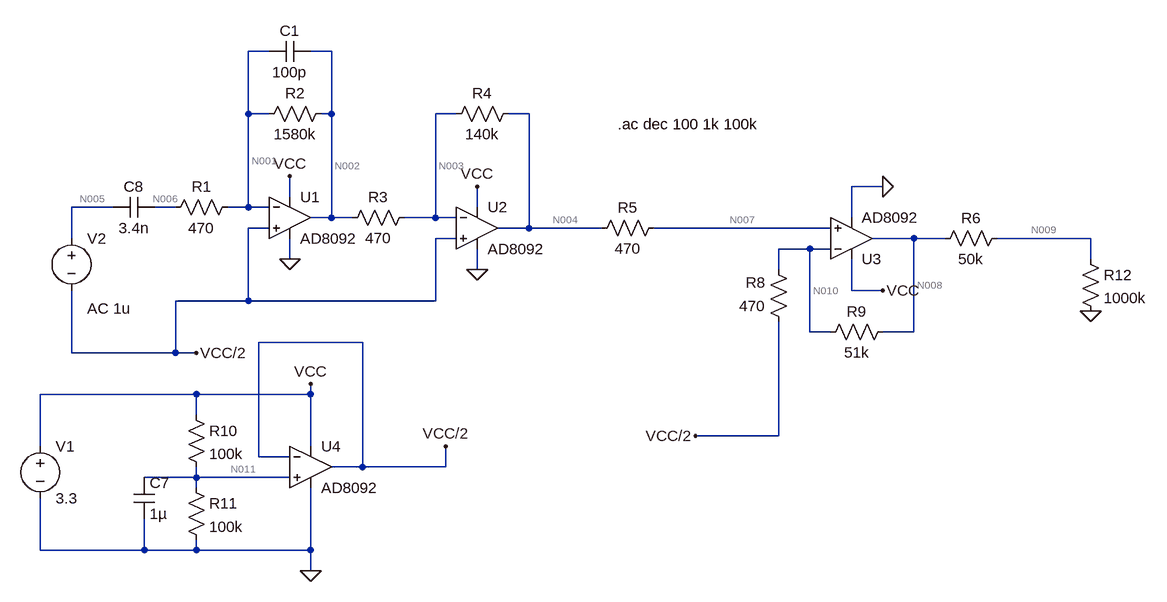
[diagram p0: schematic Amplifier.asc]
Amplifier.asc, the LTspice schematic file:
Version 4
SHEET 1 1376 696
WIRE 16 -144 -16 -144
WIRE 112 -144 80 -144
WIRE -16 -48 -16 -144
WIRE 16 -48 -16 -48
WIRE 112 -48 112 -144
WIRE 112 -48 96 -48
WIRE 304 -48 272 -48
WIRE 416 -48 384 -48
WIRE 960 64 912 64
WIRE 48 80 48 48
WIRE -224 96 -288 96
WIRE -128 96 -160 96
WIRE -16 96 -16 -48
WIRE -16 96 -48 96
WIRE 16 96 -16 96
WIRE 336 96 336 64
WIRE 112 112 112 -48
WIRE 112 112 80 112
WIRE 144 112 112 112
WIRE 272 112 272 -48
WIRE 272 112 224 112
WIRE 304 112 272 112
WIRE 912 112 912 64
WIRE 16 128 -16 128
WIRE 416 128 416 -48
WIRE 416 128 368 128
WIRE 528 128 416 128
WIRE 880 128 608 128
WIRE -288 144 -288 96
WIRE 304 144 272 144
WIRE 1008 144 944 144
WIRE 1056 144 1008 144
WIRE 1280 144 1136 144
WIRE 848 160 800 160
WIRE 880 160 848 160
WIRE 48 176 48 144
WIRE 1280 176 1280 144
WIRE 336 192 336 160
WIRE 800 192 800 160
WIRE 912 224 912 176
WIRE 960 224 912 224
WIRE -16 240 -16 128
WIRE -16 240 -128 240
WIRE 272 240 272 144
WIRE 272 240 -16 240
WIRE 848 288 848 160
WIRE 880 288 848 288
WIRE 1008 288 1008 144
WIRE 1008 288 960 288
WIRE 160 304 0 304
WIRE -288 320 -288 224
WIRE -128 320 -128 240
WIRE -128 320 -288 320
WIRE -96 320 -128 320
WIRE -96 384 -336 384
WIRE 80 384 80 368
WIRE 80 384 -96 384
WIRE -96 416 -96 384
WIRE 800 448 800 272
WIRE 800 448 672 448
WIRE -336 464 -336 384
WIRE 80 464 80 384
WIRE 0 480 0 304
WIRE 48 480 0 480
WIRE 160 496 160 304
WIRE 160 496 112 496
WIRE 288 496 288 464
WIRE 288 496 160 496
WIRE -96 512 -96 496
WIRE -96 512 -176 512
WIRE 48 512 -96 512
WIRE -96 528 -96 512
WIRE -336 624 -336 544
WIRE -176 624 -176 576
WIRE -176 624 -336 624
WIRE -96 624 -96 608
WIRE -96 624 -176 624
WIRE 80 624 80 528
WIRE 80 624 -96 624
WIRE 80 656 80 624
FLAG 48 48 VCC
FLAG 336 64 VCC
FLAG 960 224 VCC
FLAG 80 368 VCC
FLAG 48 176 0
FLAG 336 192 0
FLAG 960 64 0
FLAG 80 656 0
FLAG 288 464 VCC/2
FLAG 672 448 VCC/2
FLAG 1280 256 0
FLAG -96 320 VCC/2
SYMBOL Opamps\\AD8092 48 48 R0
SYMATTR InstName U1
SYMBOL Opamps\\AD8092 336 64 R0
SYMATTR InstName U2
SYMBOL Opamps\\AD8092 912 208 M180
SYMATTR InstName U3
SYMBOL Opamps\\AD8092 80 432 R0
SYMATTR InstName U4
SYMBOL res -32 80 R90
WINDOW 0 0 56 VBottom 2
WINDOW 3 32 56 VTop 2
SYMATTR InstName R1
SYMATTR Value 470
SYMBOL res 112 -64 R90
WINDOW 0 0 56 VBottom 2
WINDOW 3 32 56 VTop 2
SYMATTR InstName R2
SYMATTR Value 1580k
SYMBOL res 240 96 R90
WINDOW 0 0 56 VBottom 2
WINDOW 3 32 56 VTop 2
SYMATTR InstName R3
SYMATTR Value 470
SYMBOL res 400 -64 R90
WINDOW 0 0 56 VBottom 2
WINDOW 3 32 56 VTop 2
SYMATTR InstName R4
SYMATTR Value 140k
SYMBOL cap 80 -160 R90
WINDOW 0 0 32 VBottom 2
WINDOW 3 32 32 VTop 2
SYMATTR InstName C1
SYMATTR Value 100p
SYMBOL cap -192 512 R0
SYMATTR InstName C7
SYMATTR Value 1µ
SYMBOL res 816 288 R180
WINDOW 0 36 76 Left 2
WINDOW 3 36 40 Left 2
SYMATTR InstName R8
SYMATTR Value 470
SYMBOL res 864 304 R270
WINDOW 0 32 56 VTop 2
WINDOW 3 0 56 VBottom 2
SYMATTR InstName R9
SYMATTR Value 51k
SYMBOL res -112 400 R0
SYMATTR InstName R10
SYMATTR Value 100k
SYMBOL res -112 512 R0
SYMATTR InstName R11
SYMATTR Value 100k
SYMBOL res 1264 160 R0
SYMATTR InstName R12
SYMATTR Value 1000k
SYMBOL voltage -336 448 R0
WINDOW 123 0 0 Left 0
WINDOW 39 0 0 Left 0
SYMATTR InstName V1
SYMATTR Value 3.3
SYMBOL cap -160 80 R90
WINDOW 0 0 32 VBottom 2
WINDOW 3 32 32 VTop 2
SYMATTR InstName C8
SYMATTR Value 3.4n
SYMBOL voltage -288 128 R0
WINDOW 123 24 124 Left 2
WINDOW 39 0 0 Left 0
SYMATTR InstName V2
SYMATTR Value ""
SYMATTR Value2 AC 1u
SYMBOL res 512 144 R270
WINDOW 0 32 56 VTop 2
WINDOW 3 0 56 VBottom 2
SYMATTR InstName R5
SYMATTR Value 470
SYMBOL res 1040 160 R270
WINDOW 0 32 56 VTop 2
WINDOW 3 0 56 VBottom 2
SYMATTR InstName R6
SYMATTR Value 50k
TEXT 552 -32 Left 2 !.ac dec 100 1k 100k

The netlist it stands for:
* Amplifier.asc
XU1 VCC/2 N001 VCC 0 N002 AD8092  ; pins In+ In- V+ V- OUT
XU2 VCC/2 N003 VCC 0 N004 AD8092  ; pins In+ In- V+ V- OUT
XU3 N007 N010 VCC 0 N008 AD8092  ; pins In+ In- V+ V- OUT
XU4 N011 VCC/2 VCC 0 VCC/2 AD8092  ; pins In+ In- V+ V- OUT
R1 N001 N006 470
R2 N002 N001 1580k
R3 N003 N002 470
R4 N004 N003 140k
C1 N002 N001 100p
C7 N011 0 1µ
R8 VCC/2 N010 470
R9 N010 N008 51k
R10 VCC N011 100k
R11 N011 0 100k
R12 N009 0 1000k
V1 VCC 0 3.3
C8 N006 N005 3.4n
V2 N005 VCC/2 AC 1u
R5 N004 N007 470
R6 N008 N009 50k
.ac dec 100 1k 100k
.backanno
.end

* Results of the author's LTspice run, read from the files saved beside the schematic
* Operating Point, zero values left out:
*   V(n001) = 1.668 V
*   V(vcc/2) = 1.666 V
*   V(vcc) = 3.3 V
*   V(n002) = 903.6 mV
*   V(n003) = 911.8 mV
*   V(n004) = 3.219 V
*   V(n010) = 1.681 V
*   V(n007) = 3.218 V
*   V(n008) = 3.218 V
*   V(n011) = 1.664 V
*   V(n006) = 1.668 V
*   V(n009) = 3.065 V
*   V(n005) = 1.666 V
*   I(R6) = 3.065 µA
*   I(R5) = 101.4 nA
*   I(R12) = 3.065 µA
*   I(R11) = 16.64 µA
*   I(R10) = 16.36 µA
*   I(R9) = -30.15 µA
*   I(R8) = -31.04 µA
*   I(R4) = 16.48 µA
*   I(R3) = 17.41 µA
*   I(R2) = -483.8 nA
*   I(V1) = -5.673 mA
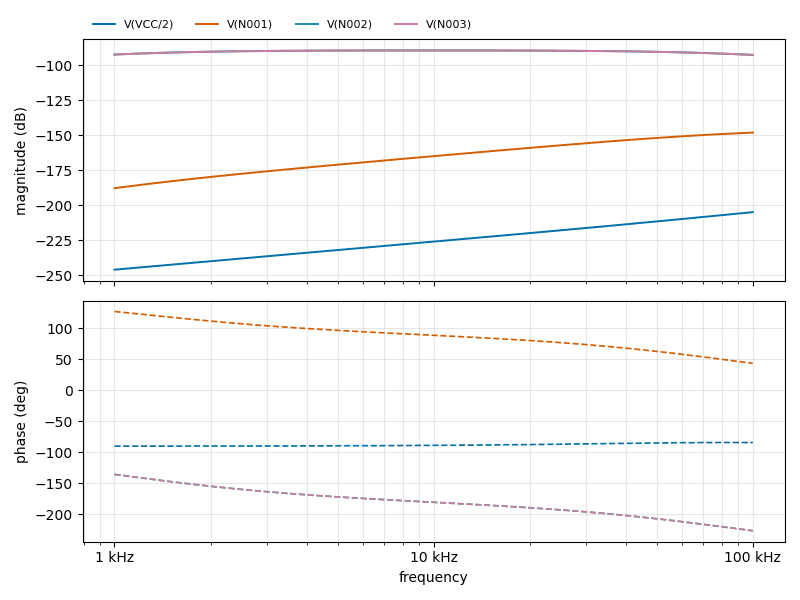
[diagram p1: AC Analysis of Amplifier.asc, plotted from the saved traces]
* AC Analysis, 1 run:
*   V(VCC/2): -246.05 dB at 1 kHz, -204.96 dB at 100 kHz, peak -204.96 dB at 100 kHz, 3 dB below the peak at 73.09 kHz
*   V(N001): -187.84 dB at 1 kHz, -148.14 dB at 100 kHz, peak -148.14 dB at 100 kHz, 3 dB below the peak at 56.56 kHz
*   V(N002): -92.41 dB at 1 kHz, -92.64 dB at 100 kHz, peak -89.46 dB at 9.772 kHz, 3 dB below the peak at 96.18 kHz
*   V(N003): -92.44 dB at 1 kHz, -92.68 dB at 100 kHz, peak -89.49 dB at 9.772 kHz, 3 dB below the peak at 96.18 kHz